# EAGLE design antennenanalysator_m4_1 (EAGLE 7.5.0)
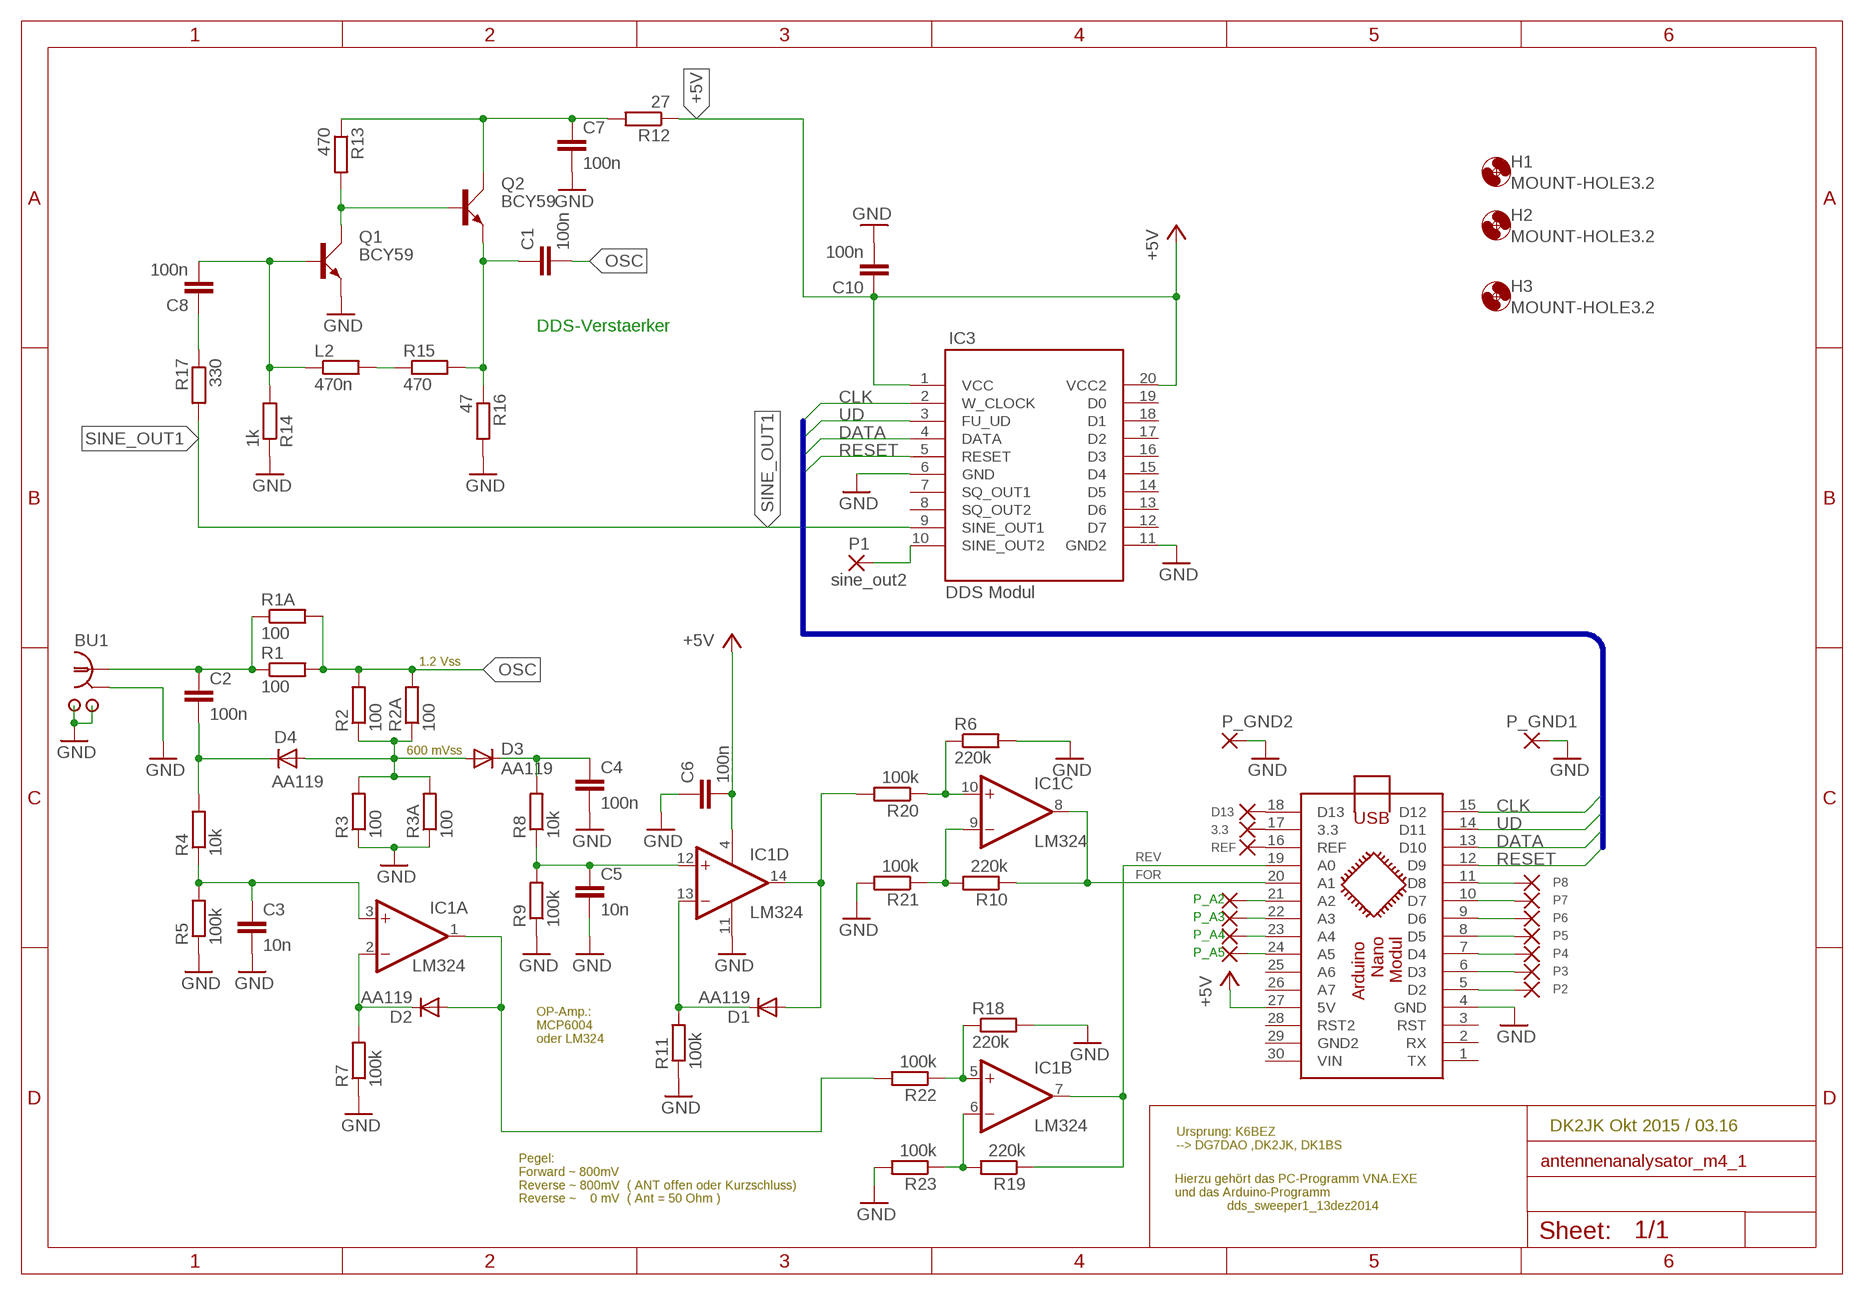
[diagram p0: schematic, sheet 1]

## Parts
3.3  1,6/0,8  [1,6/0,8]
ARDIUNO_NANO  ARDUINO_NANO  [ARDUINO_NANO]
BU1  BNC_1BNC_L  [BNC]
C1  100n  C-EU025-025X050  [C025-025X050]
C2  100n  C-EU025-025X050  [C025-025X050]
C3  10n  C-EU025-025X050  [C025-025X050]
C4  100n  C-EU025-025X050  [C025-025X050]
C5  10n  C-EU025-025X050  [C025-025X050]
C6  100n  C-EU025-025X050  [C025-025X050]
C7  100n  C-EU025-025X050  [C025-025X050]
C8  100n  C-EU025-025X050  [C025-025X050]
C10  100n  C-EU025-025X050  [C025-025X050]
D1  AA119  [DO07]
D2  AA119  [DO07]
D3  AA119  [DO07]
D4  AA119  [DO07]
D13  1,6/0,8  [1,6/0,8]
H1  MOUNT-HOLE3.2  [3,2]
H2  MOUNT-HOLE3.2  [3,2]
H3  MOUNT-HOLE3.2  [3,2]
IC1  LM324  LM324N  [DIL14]
IC3  DDS Modul  MODULE  [MODULE]
L2  470n  R-EU_0207/10  [0207/10]
P1  sine_out2  1,6/0,8  [1,6/0,8]
P2  1,6/0,8  [1,6/0,8]
P3  1,6/0,8  [1,6/0,8]
P4  1,6/0,8  [1,6/0,8]
P5  1,6/0,8  [1,6/0,8]
P6  1,6/0,8  [1,6/0,8]
P7  1,6/0,8  [1,6/0,8]
P8  1,6/0,8  [1,6/0,8]
P_A2  1,6/0,8  [1,6/0,8]
P_A3  1,6/0,8  [1,6/0,8]
P_A4  1,6/0,8  [1,6/0,8]
P_A5  1,6/0,8  [1,6/0,8]
P_GND1  1,6/0,8  [1,6/0,8]
P_GND2  1,6/0,8  [1,6/0,8]
Q1  BCY59  2N2222  [TO18A]
Q2  BCY59  2N2222  [TO18A]
R1  100  R-EU_0207/10  [0207/10]
R1A  100  R-EU_0207/10  [0207/10]
R2  100  R-EU_0207/10  [0207/10]
R2A  100  R-EU_0207/10  [0207/10]
R3  100  R-EU_0207/10  [0207/10]
R3A  100  R-EU_0207/10  [0207/10]
R4  10k  R-EU_0207/10  [0207/10]
R5  100k  R-EU_0207/10  [0207/10]
R6  220k  R-EU_0207/10  [0207/10]
R7  100k  R-EU_0207/10  [0207/10]
R8  10k  R-EU_0207/10  [0207/10]
R9  100k  R-EU_0207/10  [0207/10]
R10  220k  R-EU_0207/10  [0207/10]
R11  100k  R-EU_0207/10  [0207/10]
R12  27  R-EU_0207/10  [0207/10]
R13  470  R-EU_0207/10  [0207/10]
R14  1k  R-EU_0207/10  [0207/10]
R15  470  R-EU_0207/10  [0207/10]
R16  47  R-EU_0207/10  [0207/10]
R17  330  R-EU_0207/10  [0207/10]
R18  220k  R-EU_0207/10  [0207/10]
R19  220k  R-EU_0207/10  [0207/10]
R20  100k  R-EU_0207/10  [0207/10]
R21  100k  R-EU_0207/10  [0207/10]
R22  100k  R-EU_0207/10  [0207/10]
R23  100k  R-EU_0207/10  [0207/10]
REF  1,6/0,8  [1,6/0,8]

## Nets
+5V: ARDIUNO_NANO.27(5V) C6.2 C10.1 IC1.4(P:V+) IC3.1(VCC) IC3.20(VCC2) R12.1
ANT: BU1.SIGNAL(SEELE) C2.1 R1.1 R1A.1
CLK: ARDIUNO_NANO.15(D12) IC3.2(W_CLOCK)
D3_K: C4.1 D3.C R8.2
D4_K: C2.2 D4.C R4.2
DATA: ARDIUNO_NANO.13(D10) IC3.4(DATA)
FOR: ARDIUNO_NANO.20(A1) IC1.8(C:OUT) R10.1
GND: ARDIUNO_NANO.4(GND) BU1.GND BU1.M1 BU1.M2 C3.2 C4.2 C5.2 C6.1 C7.2 C10.2 IC1.11(P:V-) IC3.6(GND) IC3.11(GND2) P_GND1.1(P) P_GND2.1(P) Q1.E R3.1 R3A.1 R5.1 R6.2 R7.1 R9.1 R11.1 R14.1 R16.2 R18.2 R21.2 R23.2
N$1: C3.1 IC1.3(A:+IN) R4.1 R5.2
N$4: ARDIUNO_NANO.16(REF) REF.1(P)
N$5: D3.A D4.A R2.1 R2A.1 R3.2 R3A.2
N$6: D2.C IC1.2(A:-IN) R7.2
N$7: 3.3.1(P) ARDIUNO_NANO.17(3.3)
N$8: ARDIUNO_NANO.18(D13) D13.1(P)
N$9: C5.1 IC1.12(D:+IN) R8.1 R9.2
N$10: D1.C IC1.13(D:-IN) R11.2
N$11: C7.1 Q2.C R12.2 R13.1
N$12: C8.1 R17.1
N$13: L2.2 R15.1
N$14: Q1.C Q2.B R13.2
N$15: C1.1 Q2.E R15.2 R16.1
N$16: C8.2 L2.1 Q1.B R14.2
N$17: IC3.10(SINE_OUT2) P1.1(P)
N$18: ARDIUNO_NANO.11(D8) P8.1(P)
N$20: ARDIUNO_NANO.10(D7) P7.1(P)
N$21: ARDIUNO_NANO.9(D6) P6.1(P)
N$22: ARDIUNO_NANO.8(D5) P5.1(P)
N$23: ARDIUNO_NANO.7(D4) P4.1(P)
N$24: ARDIUNO_NANO.6(D3) P3.1(P)
N$25: ARDIUNO_NANO.5(D2) P2.1(P)
N$26: ARDIUNO_NANO.21(A2) P_A2.1(P)
N$28: D1.A IC1.14(D:OUT) R20.2
N$30: IC1.9(C:-IN) R10.2 R21.1
N$32: D2.A IC1.1(A:OUT) R22.2
N$33: IC1.6(B:-IN) R19.2 R23.1
N$34: ARDIUNO_NANO.22(A3) P_A3.1(P)
N$35: ARDIUNO_NANO.23(A4) P_A4.1(P)
N$36: IC1.5(B:+IN) R18.1 R22.1
N$37: IC1.10(C:+IN) R6.1 R20.1
N$38: ARDIUNO_NANO.24(A5) P_A5.1(P)
OSC: C1.2 R1.2 R1A.2 R2.2 R2A.2
RESET: ARDIUNO_NANO.12(D9) IC3.5(RESET)
REV: ARDIUNO_NANO.19(A0) IC1.7(B:OUT) R19.1
SINE_OUT1: IC3.9(SINE_OUT1) R17.2
UD: ARDIUNO_NANO.14(D11) IC3.3(FU_UD)
Unconnected: ARDIUNO_NANO.1(TX) ARDIUNO_NANO.2(RX) ARDIUNO_NANO.3(RST) ARDIUNO_NANO.25(A6) ARDIUNO_NANO.26(A7) ARDIUNO_NANO.28(RST2) ARDIUNO_NANO.29(GND2) ARDIUNO_NANO.30(VIN) IC3.7(SQ_OUT1) IC3.8(SQ_OUT2) IC3.12(D7) IC3.13(D6) IC3.14(D5) IC3.15(D4) IC3.16(D3) IC3.17(D2) IC3.18(D1) IC3.19(D0)

## Buses
DDS:CLK,UD,DATA,RESET

## Notes on the sheet
- DDS-Verstaerker
- 1.2 Vss
- 600 mVss
- OP-Amp.: 
  MCP6004  
  oder LM324
- DK2JK Okt 2015 / 03.16
- Ursprung: K6BEZ
  --> DG7DAO ,DK2JK, DK1BS
- Pegel:
  Forward ~ 800mV
  Reverse ~ 800mV  ( ANT offen oder Kurzschluss)
  Reverse ~    0 mV  ( Ant = 50 Ohm )
- Hierzu gehört das PC-Programm VNA.EXE
  und das Arduino-Programm
                 dds_sweeper1_13dez2014

## Library data of the parts
3.3 D13 P1-P8 P_A2-P_A5 P_GND1 P_GND2 REF = wirepad:1,6/0,8: THROUGH-HOLE PAD
ARDIUNO_NANO = dk2jk:ARDUINO_NANO: arduino Nano Modul
BU1 = 00_dk1jk:BNC_1: bnc buchse mit lötpads zur befestingung
C1-C8 C10 = aa_m4:C-EU: CAPACITOR, European symbol
D1-D4 = diode:AA119: DIODE germanium
H1-H3 = holes:MOUNT-HOLE: MOUNTING HOLE with drill center marker
IC1 = linear:LM324: OP AMP
IC3 = DDS Module:MODULE: AD9850 DDS Module, widely available on eBay for very low cost
L2 R1 R1A R2 R2A R3 R3A R4 R5 R7-R9 R11-R17 R20-R23 = aa_m4:R-EU_: RESISTOR, European symbol
Q1 Q2 = transistor-small-signal:2N2222: NPN TRANSISTOR
R6 R10 R18 R19 = rcl:R-EU_: RESISTOR, European symbol

## Board
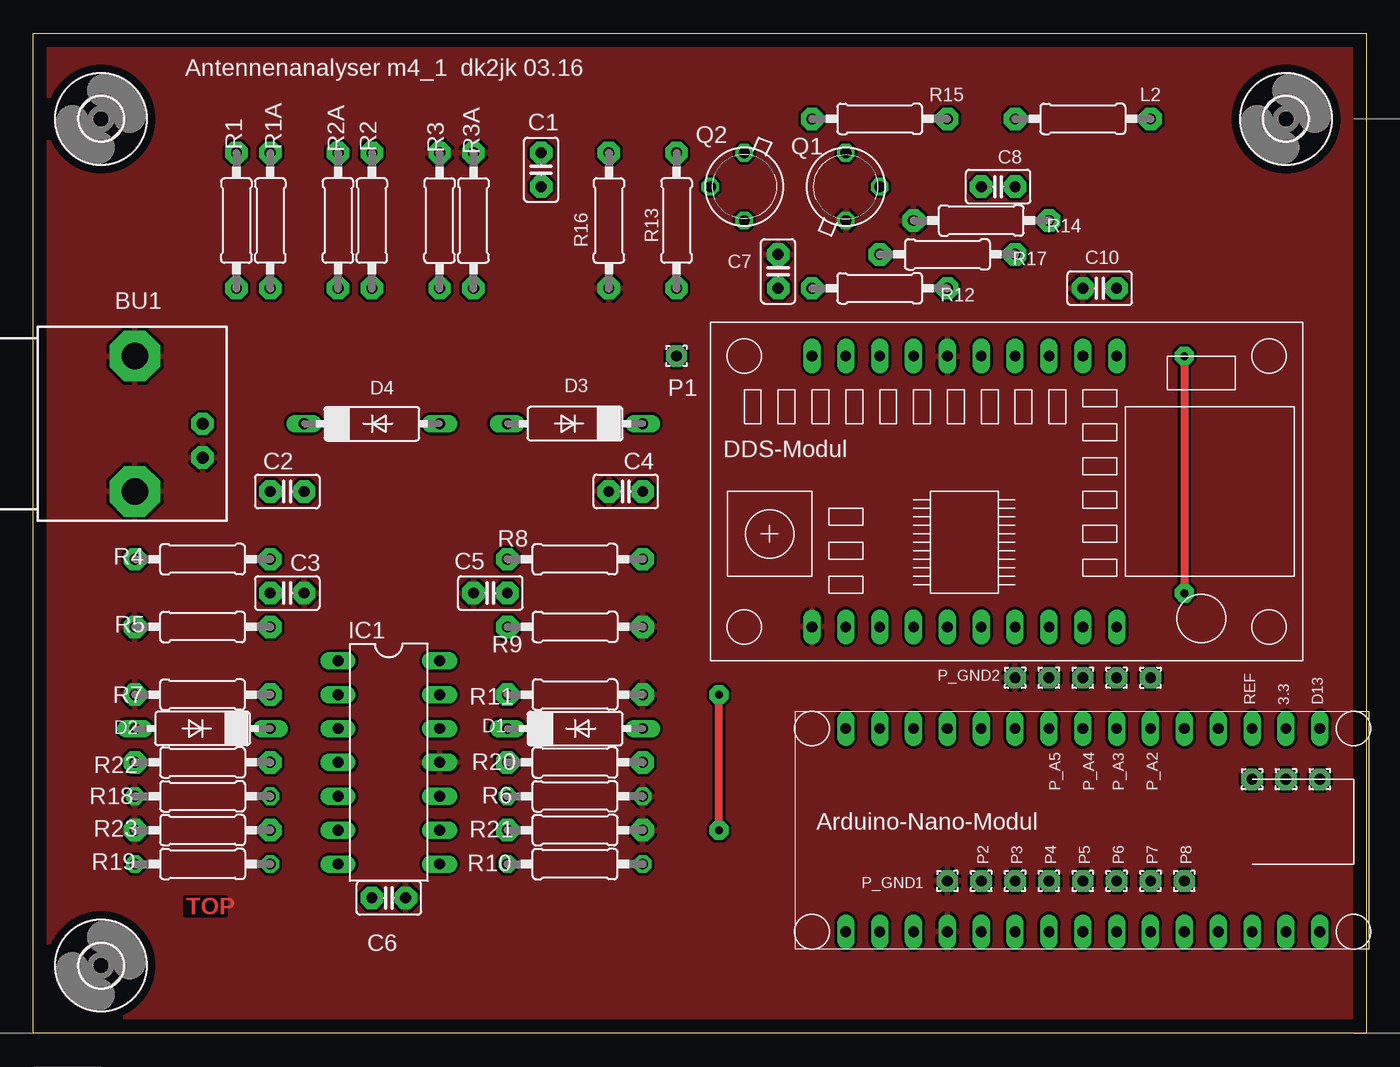
[diagram p1: board, top side]
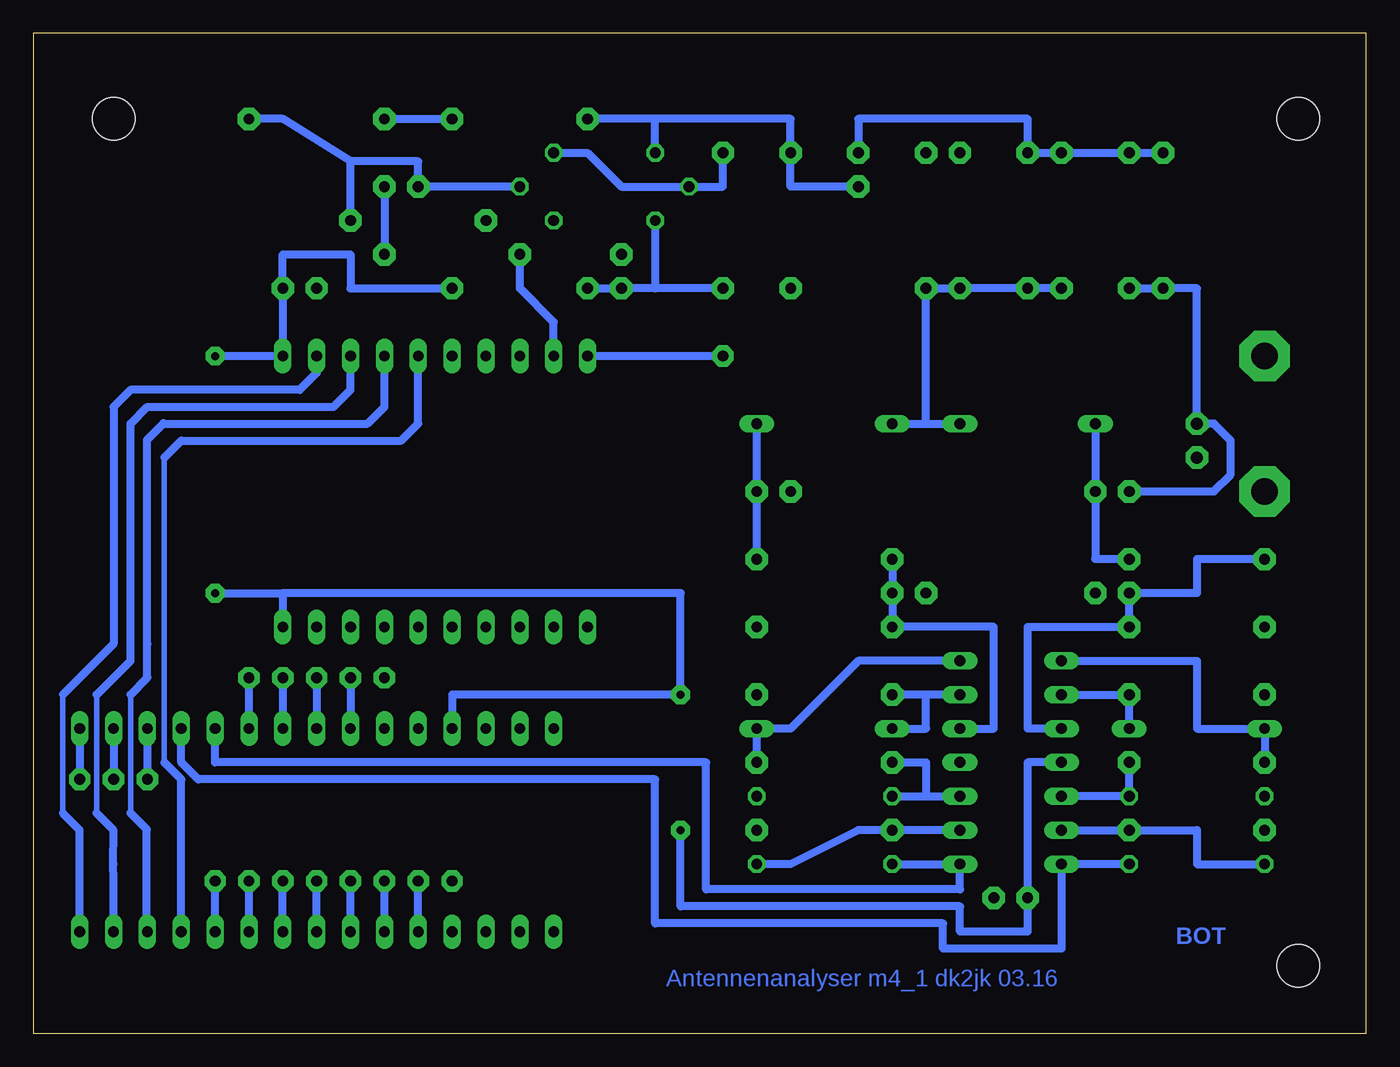
[diagram p2: board, bottom side, seen from below]

Size 100 x 75 mm. Coordinates in mm from the lower left corner, seen from the top.
Outline: 0,75 100,75 100,0 0,0 0,75
Copper layers (1*16): Top 0.035mm / dielectric 1.5mm / Bottom 0.035mm
Design rules "default": minimum track width 10mil, minimum drill 24mil, track to track 8mil, track to pad 8mil, pad to pad 8mil, via to via 8mil, smd to smd 8mil, copper to edge 40mil, drill to drill 8mil, minimum pad ring 10mil, minimum via ring 8mil, stop-mask expansion 4mil, vias tented up to drill 0mil, thermal gap 10mil

### Footprints (pad centres in the part's own frame; a part is rotated, then mirrored left to right if it is on the bottom)
1,6/0,8 = drill 0.813 pad 1.6 octagon: 1 0,0
ARDUINO_NANO = drill 0.8 long: 1 -7.62,19.05; 2 -7.62,16.51; 3 -7.62,13.97; 4 -7.62,11.43; 5 -7.62,8.89; 6 -7.62,6.35; 7 -7.62,3.81; 8 -7.62,1.27; 9 -7.62,-1.27; 10 -7.62,-3.81; 11 -7.62,-6.35; 12 -7.62,-8.89; 13 -7.62,-11.43; 14 -7.62,-13.97; 15 -7.62,-16.51; 16 7.62,-11.43; 17 7.62,-13.97; 18 7.62,-16.51; 19 7.62,-8.89; 20 7.62,-6.35; 21 7.62,-3.81; 22 7.62,-1.27; 23 7.62,1.27; 24 7.62,3.81; 25 7.62,6.35; 26 7.62,8.89; 27 7.62,11.43; 28 7.62,13.97; 29 7.62,16.51; 30 7.62,19.05
BNC = drill 0.9 pad 1.676 octagon: GND -2.54,-5.08; SIGNAL 0,-5.08 | drill 2 pad 3.81 octagon: M1 -5.08,0; M2 5.08,0
C025-025X050 = drill 0.813 pad 1.676 octagon: 1 -1.27,0; 2 1.27,0
DO07 = drill 0.813 long: A 5.08,0; C -5.08,0
3,2 = hole 3.2: 0,0
DIL14 = drill 0.813 long: 1 -7.62,-3.81; 2 -5.08,-3.81; 3 -2.54,-3.81; 4 0,-3.81; 5 2.54,-3.81; 6 5.08,-3.81; 7 7.62,-3.81; 8 7.62,3.81; 9 5.08,3.81; 10 2.54,3.81; 11 0,3.81; 12 -2.54,3.81; 13 -5.08,3.81; 14 -7.62,3.81
MODULE = drill 0.8 long: 1 -10.16,11.43; 2 -10.16,8.89; 3 -10.16,6.35; 4 -10.16,3.81; 5 -10.16,1.27; 6 -10.16,-1.27; 7 -10.16,-3.81; 8 -10.16,-6.35; 9 -10.16,-8.89; 10 -10.16,-11.43; 11 10.16,-11.43; 12 10.16,-8.89; 13 10.16,-6.35; 14 10.16,-3.81; 15 10.16,-1.27; 16 10.16,1.27; 17 10.16,3.81; 18 10.16,6.35; 19 10.16,8.89; 20 10.16,11.43
0207/10 = drill 0.813 pad 1.676 octagon: 1 -5.08,0; 2 5.08,0
TO18A = drill 0.813 octagon: B 2.54,0; C 0,2.54; E 0,-2.54
0207/10' = drill 0.813 octagon: 1 -5.08,0; 2 5.08,0

### Placement (x,y rotation side)
3.3  93.98,19.05 0 top
ARDIUNO_NANO  80.01,15.24 90 top
BU1  7.62,45.72 90 top
C1  38.1,64.77 90 top
C2  19.05,40.64 0 top
C3  19.05,33.02 0 top
C4  44.45,40.64 180 top
C5  34.29,33.02 180 top
C6  26.67,10.16 180 top
C7  55.88,57.15 90 top
C8  72.39,63.5 180 top
C10  80.01,55.88 180 top
D1  40.64,22.86 0 top
D2  12.7,22.86 180 top
D3  40.64,45.72 180 top
D4  25.4,45.72 0 top
D13  96.52,19.05 0 top
H1  93.98,68.58 0 top
H2  5.08,5.08 0 top
H3  5.08,68.58 0 top
IC1  26.67,20.32 270 top
IC3  69.85,40.64 270 top
L2  78.74,68.58 180 top
P1  48.26,50.8 0 top
P2  71.12,11.43 270 top
P3  73.66,11.43 270 top
P4  76.2,11.43 270 top
P5  78.74,11.43 270 top
P6  81.28,11.43 270 top
P7  83.82,11.43 270 top
P8  86.36,11.43 270 top
P_A2  83.82,26.67 180 top
P_A3  81.28,26.67 270 top
P_A4  78.74,26.67 270 top
P_A5  76.2,26.67 270 top
P_GND1  68.58,11.43 0 top
P_GND2  73.66,26.67 0 top
Q1  60.96,63.5 0 top
Q2  53.34,63.5 180 top
R1  15.24,60.96 90 top
R1A  17.78,60.96 90 top
R2  25.4,60.96 90 top
R2A  22.86,60.96 90 top
R3  30.48,60.96 270 top
R3A  33.02,60.96 270 top
R4  12.7,35.56 0 top
R5  12.7,30.48 0 top
R6  220k  [0207/10']  40.64,17.78 0 top
R7  12.7,25.4 0 top
R8  40.64,35.56 0 top
R9  40.64,30.48 180 top
R10  220k  [0207/10']  40.64,12.7 0 top
R11  40.64,25.4 180 top
R12  63.5,55.88 180 top
R13  48.26,60.96 90 top
R14  71.12,60.96 0 top
R15  63.5,68.58 180 top
R16  43.18,60.96 270 top
R17  68.58,58.42 180 top
R18  220k  [0207/10']  12.7,17.78 180 top
R19  220k  [0207/10']  12.7,12.7 180 top
R20  40.64,20.32 0 top
R21  40.64,15.24 0 top
R22  12.7,20.32 180 top
R23  12.7,15.24 180 top
REF  91.44,19.05 0 top

### Tracks (layer width: path | path; a pad name or v marks a point on that pad's centre or on a via)
+5V  (via drill 0.6 pad 1.42)
  Top 0.61: v51.44,15.24 v51.44,25.4 | v86.36,50.8 v86.36,33.02
  Bottom 0.61: ARDIUNO_NANO.27 68.58,25.4 v51.44,25.4 51.44,33.02 81.28,33.02 | v86.36,50.8 IC3.1 C10.1 81.28,58.42 76.2,58.42 76.2,55.88 R12.1 | v86.36,33.02 81.28,33.02 | 81.28,33.02 IC3.20 | v51.44,15.24 51.44,9.53 30.48,9.53 30.48,7.62 25.4,7.62 C6.2 25.4,20.32 IC1.4
ANT
  Bottom 0.61: R1A.1 R1.1 12.7,55.88 BU1.SIGNAL 11.43,45.72 10.16,44.45 10.16,41.91 11.43,40.64 C2.1
CLK
  Bottom 0.406: 97.79,25.4 97.79,16.51
  Bottom 0.61: IC3.2 78.74,49.53 80.01,48.26 92.71,48.26 93.98,46.99 93.98,29.21 97.79,25.4 | 97.79,16.51 96.52,15.24 ARDIUNO_NANO.15
D3_K
  Bottom 0.61: R8.2 C4.1 D3.C
D4_K
  Bottom 0.61: D4.C C2.2 20.32,35.56 R4.2
DATA
  Bottom 0.406: 92.71,16.51 92.71,25.4
  Bottom 0.61: 92.71,16.51 91.49,15.29 91.49,7.62 ARDIUNO_NANO.13 | 92.71,25.4 91.44,26.67 91.44,29.21 91.47,44.5 90.22,45.77 90.22,45.72 74.93,45.72 73.66,46.99 IC3.4
FOR
  Bottom 0.61: R10.1 IC1.8 30.48,10.79 49.53,10.79 49.53,20.32 86.36,20.32 ARDIUNO_NANO.20
GND
  pour Top: 0,75 100,75 100,0 0,0
N$1
  Bottom 0.61: IC1.3 25.4,22.86 25.4,30.48 R5.2 C3.1 12.7,33.02 12.7,35.56 R4.1
N$4
  Bottom 0.61: ARDIUNO_NANO.16 REF.1
N$5
  Bottom 0.61: R2.1 R2A.1 R3.2 R3A.2 33.02,45.72 | D3.A 33.02,45.72 | 33.02,45.72 D4.A
N$6
  Bottom 0.61: IC1.2 R7.2 D2.C
N$7
  Bottom 0.61: ARDIUNO_NANO.17 3.3.1
N$8
  Bottom 0.61: ARDIUNO_NANO.18 D13.1
N$9
  Bottom 0.61: R8.1 C5.1 R9.2 27.94,30.48 27.94,22.86 IC1.12
N$10
  Bottom 0.61: IC1.13 33.02,25.4 | 33.02,25.4 R11.2 | D1.C 33.02,22.86 33.02,25.4
N$11
  Bottom 0.61: R12.2 C7.1 53.34,55.88 | R13.1 53.34,55.88 | Q2.C 53.34,55.88
N$12
  Bottom 0.61: C8.1 R17.1
N$13
  Bottom 0.61: L2.2 R15.1
N$14
  Bottom 0.61: R13.2 48.26,63.5 Q2.B 55.88,63.5 58.42,66.04 Q1.C
N$15
  Bottom 0.61: C1.1 43.18,63.5 R16.1 43.18,68.58 53.34,68.58 | 53.34,68.58 R15.2 | Q2.E 53.34,68.58
N$16
  Bottom 0.61: Q1.B C8.2 71.12,65.41 76.2,65.41 | 76.2,65.41 81.28,68.58 L2.1 | R14.2 76.2,65.41
N$17
  Bottom 0.61: P1.1 IC3.10
N$18
  Bottom 0.61: ARDIUNO_NANO.11 P8.1
N$20
  Bottom 0.61: ARDIUNO_NANO.10 P7.1
N$21
  Bottom 0.61: ARDIUNO_NANO.9 P6.1
N$22
  Bottom 0.61: ARDIUNO_NANO.8 P5.1
N$23
  Bottom 0.61: ARDIUNO_NANO.7 P4.1
N$24
  Bottom 0.61: ARDIUNO_NANO.6 P3.1
N$25
  Bottom 0.61: ARDIUNO_NANO.5 P2.1
N$26
  Bottom 0.61: ARDIUNO_NANO.21 P_A2.1
N$28
  Bottom 0.61: R20.2 D1.A 43.18,22.86 38.1,27.94 IC1.14
N$30
  Bottom 0.61: IC1.9 R21.1 38.1,15.24 43.18,12.7 R10.2
N$32
  Bottom 0.61: R22.2 D2.A 12.7,22.86 12.7,27.94 IC1.1
N$33
  Bottom 0.61: IC1.6 R23.1 12.7,15.24 12.7,12.7 R19.2
N$34
  Bottom 0.61: P_A3.1 ARDIUNO_NANO.22
N$35
  Bottom 0.61: P_A4.1 ARDIUNO_NANO.23
N$36
  Bottom 0.61: IC1.5 R18.1 R22.1
N$37
  Bottom 0.61: R6.1 33.02,17.78 | 33.02,17.78 IC1.10 | R20.1 33.02,20.32 33.02,17.78
N$38
  Bottom 0.61: P_A5.1 ARDIUNO_NANO.24
OSC
  Bottom 0.61: R1A.2 R1.2 R2A.2 R2.2 25.4,68.58 38.1,68.58 C1.2
RESET
  Bottom 0.406: 90.17,20.32 90.17,43.18
  Bottom 0.61: 90.17,20.32 88.9,19.05 ARDIUNO_NANO.12 | 90.17,43.18 88.9,44.45 72.39,44.45 71.12,45.72 IC3.5
REV
  Bottom 0.61: R19.1 IC1.7 22.86,6.35 31.75,6.35 31.75,8.26 53.34,8.26 53.34,19.05 87.63,19.05 88.9,20.32 ARDIUNO_NANO.19
SINE_OUT1
  Bottom 0.61: IC3.9 60.96,53.34 63.5,55.88 R17.2
UD
  Bottom 0.406: 95.25,16.51 95.25,25.4
  Bottom 0.61: 95.25,16.51 93.98,15.21 94,12.7 93.98,11.43 ARDIUNO_NANO.14 | 95.25,25.4 92.71,27.94 92.71,45.72 91.44,46.99 77.47,46.99 76.2,48.26 IC3.3

### Text on the board
Top: TOP
Bottom: BOT | Antennenanalyser m4_1 dk2jk 03.16
tNames: Antennenanalyser m4_1 dk2jk 03.16 | DDS-Modul | Arduino-Nano-Modul
tDocu: für Fischer Frame Gehäuse FR 80 42 100